# EasyEDA Pro project MSDR_EzEdaPro.eprj, board PCB5
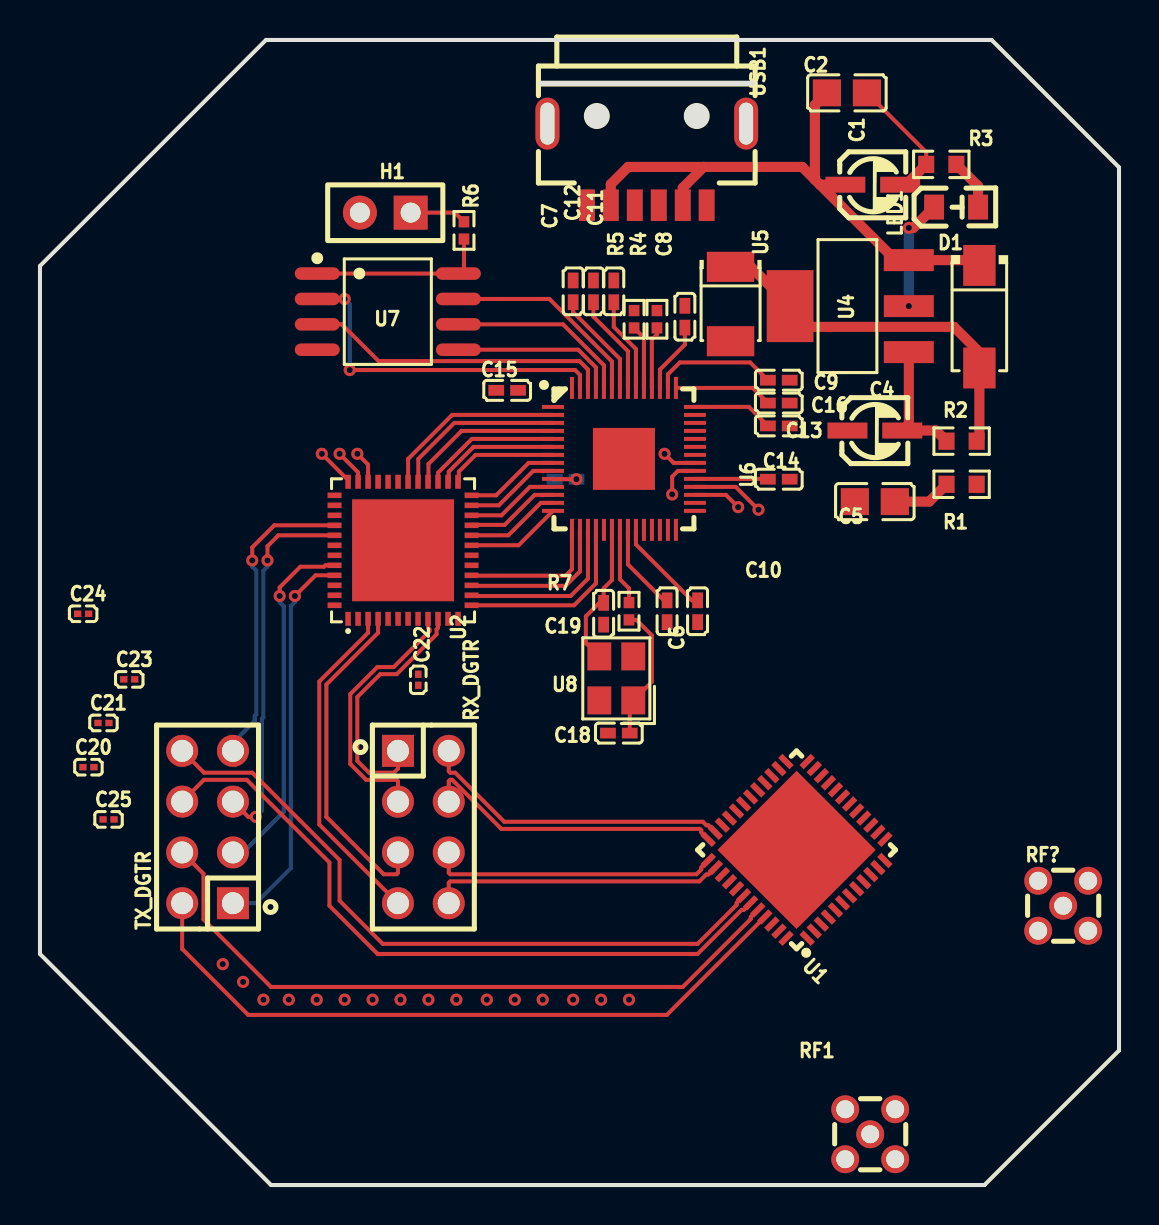
[diagram p4: board, top side]
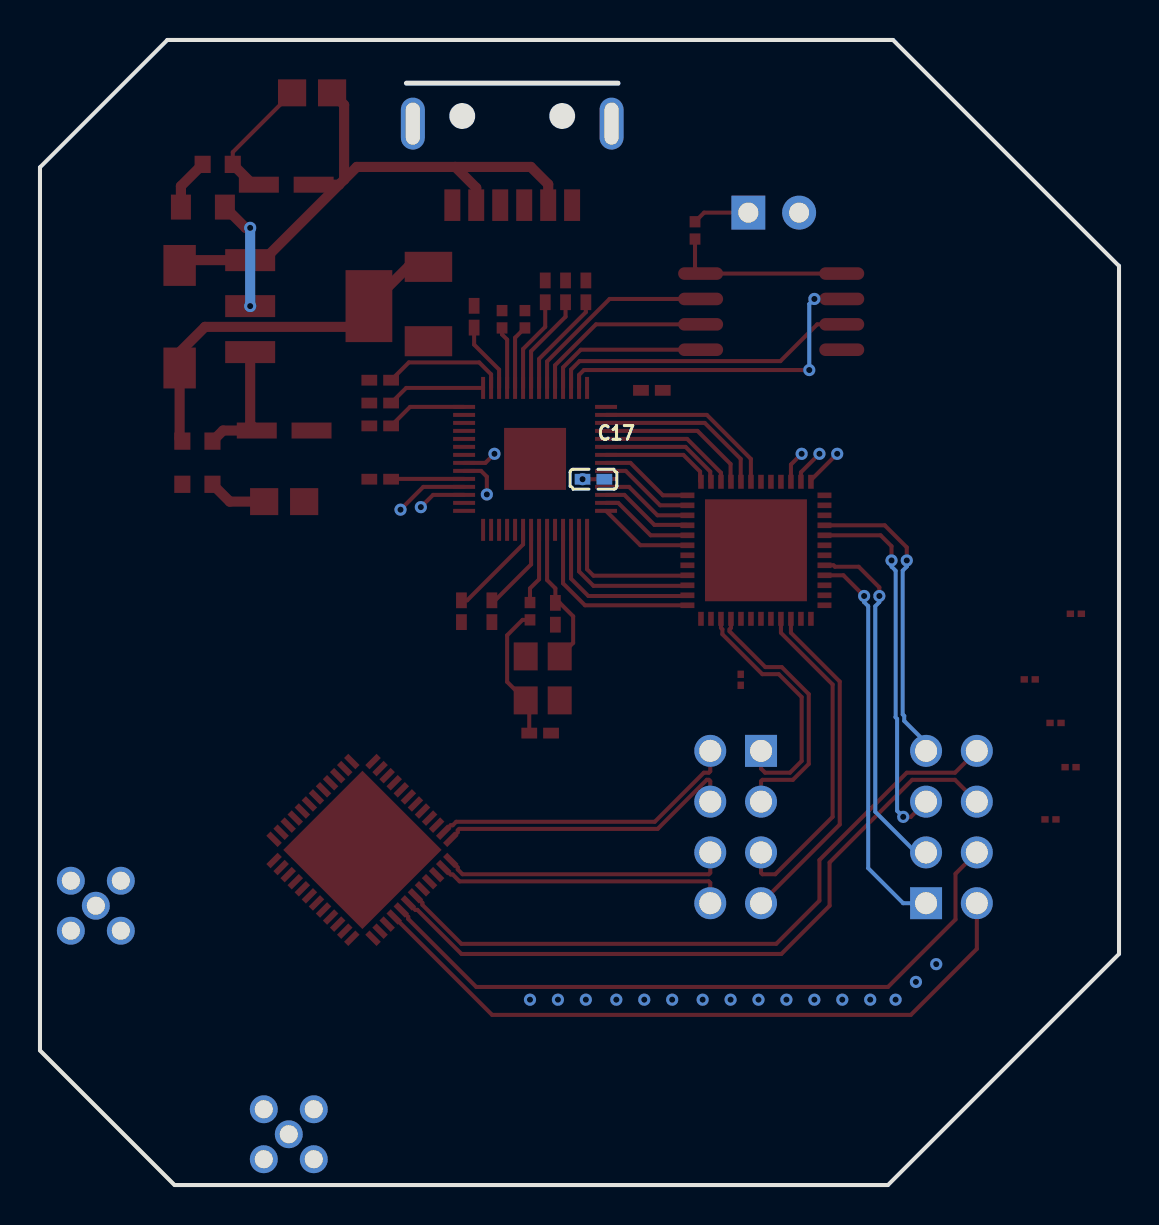
[diagram p5: board, bottom side, seen from below]

Outline 53.97 x 57.28 mm; copper layers: Top Layer, Bottom Layer. Coordinates in mm from the lower left corner of the outline.
Outline path: 0,45.97 11.3,57.28 47.6,57.28 53.97,50.91 53.97,6.73 47.24,0 11.56,0 0,11.56 0,45.97
Stack: Top Layer 0.035mm / Dielectric1 1.51mm FR4 er 4.5 / Bottom Layer 0.035mm

## Design rules (mm)
template: JLCPCB Capability(Two Layers Board)
spacing copperThickness1oz (default): track to track 0.102, other pairs 0.152 to 0.3
spacing copperThickness2oz: track to track 0.203, other pairs 0.152 to 0.3
track width copperThickness1oz (default): min 0.127, default 0.254, max 2.54
track width copperThickness2oz: min 0.203, default 0.254, max 2.54
differential pair differentialPair (default): width min 0.127, default 0.254, max 2.54; gap min 0.152, default 0.152
via viaSize (default): diameter min 0.5, default 0.61, max 10; hole min 0.3, default 0.305, max 6.3

## Placement (name value [footprint] x y rotation side)
C1  10uF  [CAP-SMD_BD3.0-L3.3-W3.3-RD]  41.66 50.04 180 top
C2  100nF  [C0805]  40.36 54.63 0 top
C4  10uF  [CAP-SMD_BD3.0-L3.3-W3.3-RD]  41.76 37.74 180 top
C5  100nF  [C0805]  41.76 34.19 0 top
C6  100nF  [C0402]  32.89 28.7 90 top
C7  100nF  [C0402]  26.67 44.7 270 top
C8  1uF  [C0402]  32.26 43.43 270 top
C9  1uF  [C0402]  36.96 40.26 180 top
C10  100nF  [C0402]  31.37 28.7 90 top
C11  100nF  [C0402]  28.7 44.7 270 top
C12  100nF  [C0402]  27.69 44.7 270 top
C13  100nF  [C0402]  36.96 37.97 180 top
C14  100nF  [C0402]  36.96 35.31 180 top
C15  100nF  [C0402]  23.37 39.75 0 top
C16  100nF  [C0402]  36.96 39.12 180 top
C17  100nF  [C0402]  26.29 35.31 0 bottom
C18  15p  [C0402]  28.96 22.61 0 top
C19  15p  [C0402]  28.19 28.58 270 top
C20  100nF  [C0201]  2.42 20.9 0 top
C21  100nF  [C0201]  3.17 23.11 0 top
C22  100nF  [C0201]  18.92 25.27 270 top
C23  100nF  [C0201]  4.47 25.29 0 top
C24  100nF  [C0201]  2.16 28.58 0 top
C25  100nF  [C0201]  3.43 18.29 0 top
D1  -  [SMA_L4.4-W2.8-LS5.4-RD]  46.99 43.43 270 top
H1  -  [HDR-TH_2P-P2.54-V-F]  17.27 48.64 180 top
LED1  -  [LED0805-RD_GREEN]  45.82 48.92 0 top
R1  10K  [R0603]  46.1 35.05 0 top
R2  10K  [R0603]  46.1 37.21 180 top
R3  10K  [R0603]  45.09 51.05 180 top
R4  10K  [R0402]  30.86 43.31 270 top
R5  10K  [R0402]  29.72 43.31 270 top
R6  1k  [R0402]  21.21 47.75 90 top
R7  10K  [R0402]  29.46 28.7 90 top
RF1  ZC11.801KK  [MMCX-TH_ZC11.801KK]  41.53 2.54 0 top
RF?  ZC11.801KK  [MMCX-TH_ZC11.801KK]  51.18 13.97 0 top
RX_DGTR  -  [HDR-TH_8P-P2.54-V-F-R2-C4-S2.54-1]  19.18 17.91 270 top
TX_DGTR  -  [HDR-TH_8P-P2.54-V-F-R2-C4-S2.54-1]  8.38 17.91 90 top
U1  MAX2831ETM+T  [TQFN-48_L7.0-W7.0-P0.50-TL-EP5.6]  37.85 16.76 135 top
U2  MAX5864ETM+  [QFN-48_L7.0-W7.0-P0.50-BL-EP5.1]  18.16 31.75 0 top
U4  AMS1117-3.3  [SOT-223-3_L6.5-W3.4-P2.30-LS7.0-BR]  40.49 43.96 0 top
U5  22uF  [CASE-B_3528]  34.54 44.07 270 top
U6  RP2040  [LQFN-56_L7.0-W7.0-P0.4-EP]  29.21 36.32 0 top
U7  W25Q128JVSIQ  [SOIC-8_L5.3-W5.3-P1.27-LS8.0-BL]  17.4 43.69 270 top
U8  ABM8-272-T3  [CRYSTAL-SMD_4P-L3.2-W2.5-BL]  28.83 25.34 90 top
USB1  USBC-0032IPX8-00  [TYPE-C-USB-SMD_USBC-0032IPX8-00]  30.35 51.05 180 top

## Footprints (pads in the part's own frame, mm; a bottom-side part is the same pattern mirrored in y, then rotated)
C0201
  rect 0.368x0.324 smd: 1(-0.275,0) 2(0.275,0)
C0402
  rect 0.79x0.54 smd: 1(-0.545,0) 2(0.545,0)
C0805
  rect 1.41x1.35 smd: 1(-1,0) 2(1,0)
CAP-SMD_BD3.0-L3.3-W3.3-RD
  rect 2x0.8 smd: 1(1.37,0) 2(-1.37,0)
CASE-B_3528
  rect 1.506x2.376 smd: 1(-1.861,0) 2(1.861,0)
CRYSTAL-SMD_4P-L3.2-W2.5-BL
  rect 1.4x1.2 smd: 1(-1.1,-0.85) 2(1.1,-0.85) 3(1.1,0.85) 4(-1.1,0.85)
HDR-TH_2P-P2.54-V-F
  rect 1.7x1.7 hole 1: 1(-1.27,0)
  round 1.7 hole 1: 2(1.27,0)
HDR-TH_8P-P2.54-V-F-R2-C4-S2.54-1
  rect 1.6x1.6 hole 1.1: 1(-3.81,-1.27)
  round 1.6 hole 1.1: 2(-3.81,1.27) 3(-1.27,-1.27) 4(-1.27,1.27) 5(1.27,-1.27) 6(1.27,1.27) 7(3.81,-1.27) 8(3.81,1.27)
LED0805-RD_GREEN
  rect 1x1.25 smd: 1(-1.1,0) 2(1.1,0)
LQFN-56_L7.0-W7.0-P0.4-EP
  rect 1.1x0.2 smd: 1(-3.55,2.6) 2(-3.55,2.2) 3(-3.55,1.8) 4(-3.55,1.4) 5(-3.55,1) 6(-3.55,0.6) 7(-3.55,0.2) 8(-3.55,-0.2) 9(-3.55,-0.6) 10(-3.55,-1) 11(-3.55,-1.4) 12(-3.55,-1.8) 13(-3.55,-2.2) 14(-3.55,-2.6) 29(3.55,-2.6) 30(3.55,-2.2) 31(3.55,-1.8) 32(3.55,-1.4) 33(3.55,-1) 34(3.55,-0.6) 35(3.55,-0.2) 36(3.55,0.2) 37(3.55,0.6) 38(3.55,1) 39(3.55,1.4) 40(3.55,1.8) 41(3.55,2.2) 42(3.55,2.6)
  rect 0.2x1.1 smd: 15(-2.6,-3.55) 16(-2.2,-3.55) 17(-1.8,-3.55) 18(-1.4,-3.55) 19(-1,-3.55) 20(-0.6,-3.55) 21(-0.2,-3.55) 22(0.2,-3.55) 23(0.6,-3.55) 24(1,-3.55) 25(1.4,-3.55) 26(1.8,-3.55) 27(2.2,-3.55) 28(2.6,-3.55) 43(2.6,3.55) 44(2.2,3.55) 45(1.8,3.55) 46(1.4,3.55) 47(1,3.55) 48(0.6,3.55) 49(0.2,3.55) 50(-0.2,3.55) 51(-0.6,3.55) 52(-1,3.55) 53(-1.4,3.55) 54(-1.8,3.55) 55(-2.2,3.55) 56(-2.6,3.55)
  rect 3.1x3.1 smd: 57(0,0)
MMCX-TH_ZC11.801KK
  round 1.4 hole 0.9: 1(0,0) 2(-1.25,1.25) 3(1.25,1.25) 4(1.25,-1.25) 5(-1.25,-1.25)
QFN-48_L7.0-W7.0-P0.50-BL-EP5.1
  rect 0.28x0.7 smd: 1(-2.75,-3.428) 2(-2.25,-3.428) 3(-1.75,-3.428) 4(-1.25,-3.428) 5(-0.75,-3.428) 6(-0.25,-3.428) 7(0.25,-3.428) 8(0.75,-3.428) 9(1.25,-3.428) 10(1.75,-3.428) 11(2.25,-3.428) 12(2.75,-3.428) 25(2.75,3.428) 26(2.25,3.428) 27(1.75,3.428) 28(1.25,3.428) 29(0.75,3.428) 30(0.25,3.428) 31(-0.25,3.428) 32(-0.75,3.428) 33(-1.25,3.428) 34(-1.75,3.428) 35(-2.25,3.428) 36(-2.75,3.428)
  rect 0.7x0.28 smd: 13(3.428,-2.75) 14(3.428,-2.25) 15(3.428,-1.75) 16(3.428,-1.25) 17(3.428,-0.75) 18(3.428,-0.25) 19(3.428,0.25) 20(3.428,0.75) 21(3.428,1.25) 22(3.428,1.75) 23(3.428,2.25) 24(3.428,2.75) 37(-3.428,2.75) 38(-3.428,2.25) 39(-3.428,1.75) 40(-3.428,1.25) 41(-3.428,0.75) 42(-3.428,0.25) 43(-3.428,-0.25) 44(-3.428,-0.75) 45(-3.428,-1.25) 46(-3.428,-1.75) 47(-3.428,-2.25) 48(-3.428,-2.75)
  rect 5.1x5.1 smd: 49(0,0)
R0402
  rect 0.566x0.54 smd: 1(-0.433,0) 2(0.433,0)
R0603
  rect 0.806x0.864 smd: 1(-0.753,0) 2(0.753,0)
SMA_L4.4-W2.8-LS5.4-RD
  rect 2.046x1.62 smd: 1(-2.566,0) 2(2.566,0)
SOIC-8_L5.3-W5.3-P1.27-LS8.0-BL
  oval 0.63x2.25 smd: 1(-1.905,-3.53) 2(-0.635,-3.53) 3(0.635,-3.53) 4(1.905,-3.53) 5(1.905,3.53) 6(0.635,3.53) 7(-0.635,3.53) 8(-1.905,3.53)
SOT-223-3_L6.5-W3.4-P2.30-LS7.0-BR
  rect 2.5x1.1 smd: 1(2.97,-2.3) 2(2.97,0) 3(2.97,2.3)
  rect 2.34x3.6 smd: 4(-2.97,0)
TQFN-48_L7.0-W7.0-P0.50-TL-EP5.6
  rect 0.8x0.3 smd: 1(-3.5,2.751) 2(-3.5,2.251) 3(-3.5,1.75) 4(-3.5,1.251) 5(-3.5,0.75) 6(-3.5,0.252) 7(-3.5,-0.249) 8(-3.5,-0.75) 9(-3.5,-1.25) 10(-3.5,-1.75) 11(-3.5,-2.249) 12(-3.5,-2.748) 25(3.5,-2.748) 26(3.5,-2.249) 27(3.5,-1.75) 28(3.5,-1.25) 29(3.5,-0.75) 30(3.5,-0.249) 31(3.5,0.252) 32(3.5,0.75) 33(3.5,1.251) 34(3.5,1.75) 35(3.5,2.251) 36(3.5,2.751)
  rect 0.3x0.8 smd: 13(-2.751,-3.5) 14(-2.251,-3.5) 15(-1.75,-3.5) 16(-1.25,-3.5) 17(-0.75,-3.5) 18(-0.251,-3.5) 19(0.249,-3.5) 20(0.75,-3.5) 21(1.25,-3.5) 22(1.75,-3.5) 23(2.251,-3.5) 24(2.751,-3.5) 37(2.751,3.5) 38(2.251,3.5) 39(1.75,3.5) 40(1.25,3.5) 41(0.75,3.5) 42(0.251,3.5) 43(-0.251,3.5) 44(-0.75,3.5) 45(-1.25,3.5) 46(-1.75,3.5) 47(-2.251,3.5) 48(-2.751,3.5)
  rect 5.6x5.6 smd: 49(0,0.001)
TYPE-C-USB-SMD_USBC-0032IPX8-00
  oval 1.2x2.6 hole 0.7x2.1: 7(-4.97,-2.04) 7(4.97,-2.04)
  rect 0.8x1.58 smd: A5(-0.6,2.04) A9(1.8,2.04) A12(2.995,2.04) B5(0.6,2.04) B9(-1.8,2.04) B12(-2.995,2.04)

## Nets
1.1V: C6.2 C7.2 C8.2 U6.23 U6.45 U6.50
3.3V: C9.2 C10.2 C11.2 C12.2 C13.2 C14.2 C15.2 C16.2 C17.2 C20.1 D1.2 R2.1 R6.1 U1.1 U1.7 U1.13 U1.17 U1.20 U1.25 U1.27 U1.30 U1.39 U1.41 U1.46 U2.33 U4.4 U5.1 U6.1 U6.10 U6.22 U6.33 U6.42 U6.43 U6.44 U6.48 U6.49 U6.56 U7.1 U7.8
+5V: C1.1 C2.1 D1.1 U4.3 USB1.A9 USB1.B9
GND: C1.2 C2.2 C4.1 C5.1 C6.1 C7.1 C8.1 C9.1 C10.1 C11.1 C12.1 C13.1 C14.1 C15.1 C16.1 C17.1 C18.1 C19.2 C21.2 C22.2 C23.2 C24.2 C25.2 H1.2 R1.2 R3.2 U1.2 U1.26 U1.31 U1.47 U2.5 U2.7 U2.12 U2.17 U2.37 U2.42 U2.47 U5.2 U6.19 U6.57 U7.4 U8.2 U8.4 USB1.A12 USB1.B12
BBC_CLK: U2.6 U6.36
BBC_CS: U2.36 U6.29
BBC_DA0: U2.13 U6.18
BBC_DA1: U2.14 U6.17
BBC_DA2: U2.15 U6.16
BBC_DA3: U2.16 U6.15
BBC_DA4: U2.19 U6.14
BBC_DA5: U2.20 U6.13
BBC_DA6: U2.21 U6.12
BBC_DA7: U2.22 U6.11
BBC_DD0: U2.23 U6.9
BBC_DD1: U2.24 U6.8
BBC_DD2: U2.25 U6.7
BBC_DD3: U2.26 U6.6
BBC_DD4: U2.27 U6.5
BBC_DD5: U2.28 U6.4
BBC_DD6: U2.29 U6.3
BBC_DD7: U2.30 U6.2
BBC_DIN: U2.34 U6.27
BBC_IN: TX_DGTR.3 U2.44
BBC_IP: TX_DGTR.1 U2.45
BBC_QN: TX_DGTR.7 U2.40
BBC_QP: TX_DGTR.5 U2.41
BBC_SCLK: U2.35 U6.28
RX_BBCIN: RX_DGTR.5 U2.4
RX_BBCIP: RX_DGTR.7 U2.3
RX_BBCQN: RX_DGTR.3 U2.9
RX_BBCQP: RX_DGTR.1 U2.10
RXN: U1.5
RXP: U1.4
TR_CLKOUT: U1.21 U6.35
TR_CS#: U1.15 U6.31
TR_DIN: U1.19 U6.34
TR_RXBBIN: RX_DGTR.6 U1.37
TR_RXBBIP: RX_DGTR.8 U1.38
TR_RXBBQN: RX_DGTR.2 U1.35
TR_RXBBQP: RX_DGTR.4 U1.36
TR_RXTX_MODE: U1.48
TR_SCLK: U1.18 U6.32
TR_SHDN#: U1.12 U6.30
TR_TXBBIN: TX_DGTR.4 U1.44
TR_TXBBIP: TX_DGTR.2 U1.45
TR_TXBBQN: TX_DGTR.8 U1.42
TR_TXBBQP: TX_DGTR.6 U1.43
TXN: U1.10
TXP: U1.9
USBC_DN: R4.1 USB1.A5
USBC_DP: R5.1 USB1.B5
$1N1972: LED1.1 U4.2
$1N2144: C4.2 C5.2 R1.1 R2.2 U4.1
$1N2960: LED1.2 R3.1
$1N3442: R5.2 U6.47
$1N3446: R4.2 U6.46
$1N4821: C20.2 U2.31 U2.32
$1N5034: U6.51 U7.7
$1N5044: U6.54 U7.3
$1N5058: U6.53 U7.5
$1N5070: U6.55 U7.2
$1N5085: U6.52 U7.6
$1N5173: H1.1 R6.2
$1N5390: C19.1 U6.20 U8.3
$1N5565: C18.2 R7.1 U8.1
$1N5572: R7.2 U6.21
$1N7470: C21.1 U2.2
$1N7508: C22.1 U2.8
$1N7546: C23.1 U2.11
$1N7584: C24.1 U2.18
$1N7821: C25.1 U2.39

Pads without a net: RF1 1 2 3 4 5; RF? 1 2 3 4 5; U1 3 6 8 11 14 16 22 23 24 28 29 32 33 34 40 49; U2 1 38 43 46 48 49; U6 24 25 26 37 38 39 40 41; USB1 7

## Via types
v1: diameter 0.61, hole 0.305, Top Layer to Bottom Layer, 33 vias

## Routing (per net, layer and track width the routed paths; a pad name or vN(x,y) marks a point on that pad's centre or on a via; arc(x,y) is an arc through that point)
1.1V: length 13.8
  Top Layer w0.203: C8.2 32.26,42.04 31.01,40.79 U6.45 ; C6.2 32.61,29.25 29.81,32.04 U6.23 ; C7.2 26.67,43.66 29.01,41.32 U6.50
3.3V: length 62.2
  Top Layer w0.203: v1(26.83,35.31) 25.68,35.31 U6.10 ; C11.2 28.7,42.93 29.81,41.82 U6.48 ; U7.1 U7.8 21.21,45.87 R6.1 ; U6.33 36.4,35.32 C14.2 ; C12.2 27.69,43.43 29.41,41.71 U6.49 ; U6.44 31.41,40.55 32,41.15 35.52,41.15 C9.2 ; U6.42 35.46,38.92 C13.2 ; C10.2 31.21,29.25 29.41,31.04 U6.22 ; U6.43 35.66,39.87 C16.2
  Top Layer w0.508: R2.1 46.99,37.35 D1.2 46.99,41.66 45.72,42.93 38.56,42.93 35.53,45.95 34.27,45.95
+5V: length 30.1
  Top Layer w0.508: 39.02,50.04 38.76,50.29 ; 39.02,50.04 C1.1 ; 39.02,50.04 42.79,46.26 U4.3 46.73,46.26 D1.1 ; 38.76,50.29 38.76,54.03 C2.1 ; 38.76,50.29 38.13,50.93 33.2,50.93 ; 32.15,49.01 32.15,49.88 33.2,50.93 ; 33.2,50.93 29.42,50.93 28.55,50.06 USB1.A9
GND: length 6.5
  Top Layer w0.203: C2.2 44.33,51.66 R3.2
  Top Layer w0.508: C1.2 43.32,50.04 R3.2
(no net):
  vias: v1(9.14,11.05) v1(10.16,10.16) v1(11.18,9.27) v1(12.45,9.27) v1(13.84,9.27) v1(15.24,9.27) v1(16.64,9.27) v1(18.03,9.27) v1(19.43,9.27) v1(20.83,9.27) v1(22.35,9.27) v1(23.75,9.27) v1(25.15,9.27) v1(26.67,9.27) v1(28.07,9.27) v1(29.46,9.27)
BBC_CS: length 1.9
  Top Layer w0.203: v1(14.1,36.58) 15.41,35.26 U2.36
BBC_DA0: length 9.4
  Top Layer w0.203: U6.18 27.81,30.1 26.71,29 U2.13
BBC_DA1: length 8.6
  Top Layer w0.203: U6.17 27.41,30.33 26.54,29.46 21.62,29.46 U2.14
BBC_DA2: length 7.8
  Top Layer w0.203: U2.15 21.62,29.97 26.29,29.97 27.01,30.69 U6.16
BBC_DA3: length 7.1
  Top Layer w0.203: U2.16 21.61,30.48 26.29,30.48 26.61,30.8 U6.15
BBC_DA4: length 4.8
  Top Layer w0.203: U2.19 21.59,32 23.94,32 U6.14
BBC_DA5: length 4.7
  Top Layer w0.203: U6.13 25.05,34.12 23.43,32.5 U2.20
BBC_DA6: length 4.7
  Top Layer w0.203: U6.12 24.74,34.52 23.24,33.02 21.61,33.02 U2.21
BBC_DA7: length 4.7
  Top Layer w0.203: U6.11 24.51,34.92 23.09,33.5 U2.22
BBC_DD0: length 4.8
  Top Layer w0.203: U6.9 24.67,35.72 22.95,34 U2.23
BBC_DD1: length 4.7
  Top Layer w0.203: U2.24 22.82,34.5 24.44,36.12 U6.8
BBC_DD2: length 5.6
  Top Layer w0.203: U2.25 20.96,35.22 20.96,35.69 21.79,36.52 U6.7
BBC_DD3: length 6.2
  Top Layer w0.203: U2.26 20.45,35.21 20.45,35.69 21.68,36.92 U6.6
BBC_DD4: length 6.9
  Top Layer w0.203: U2.27 19.91,35.63 21.6,37.32 U6.5
BBC_DD5: length 7.8
  Top Layer w0.203: U2.28 19.43,35.2 19.43,36.07 21.09,37.72 U6.4
BBC_DD6: length 8.6
  Top Layer w0.203: U2.29 18.92,35.19 18.92,36.32 20.72,38.12 U6.3
BBC_DD7: length 9.3
  Top Layer w0.203: U2.30 18.41,35.18 18.41,36.32 20.62,38.52 U6.2
BBC_DIN: length 1.6
  Top Layer w0.203: v1(15.88,36.58) 16.41,36.04 U2.34
BBC_IN: length 18
  Top Layer w0.203: U2.44 14.28,31 14.21,30.93 13.02,30.93 11.99,29.9 v1(11.99,29.46)
  Bottom Layer w0.203: TX_DGTR.3 9.81,16.48 10.01,16.48 12.19,18.67 12.19,28.96 11.99,29.16 v1(11.99,29.46)
BBC_IP: length 19.7
  Top Layer w0.203: U2.45 13.79,30.5 v1(12.75,29.46)
  Bottom Layer w0.203: v1(12.75,29.46) 12.75,29.16 12.55,28.96 12.55,15.85 10.79,14.1 TX_DGTR.1
BBC_QN: length 15.3
  Top Layer w0.203: v1(10.62,31.24) 10.62,31.9 11.72,33 U2.40
  Bottom Layer w0.203: TX_DGTR.7 9.65,22.12 10.74,23.22 10.74,23.47 10.82,23.54 10.82,30.73 10.62,30.94 v1(10.62,31.24)
BBC_QP: length 18.8
  Top Layer w0.203: TX_DGTR.5 10.41,18.42 v1(10.79,18.42) ; U2.41 11.93,32.5 11.38,31.95 v1(11.38,31.24)
  Bottom Layer w0.203: v1(10.79,18.42) 11.1,18.72 11.1,23.32 11.18,23.39 11.18,30.73 11.38,30.94 v1(11.38,31.24)
BBC_SCLK: length 1.8
  Top Layer w0.203: U2.35 15.91,35.65 v1(14.99,36.58)
RX_BBCIN: length 16.8
  Top Layer w0.203: 17.91,16.64 17.91,15.62 17.84,15.54 17.2,15.54 14.33,18.42 14.33,25.04 16.91,27.62 U2.4
RX_BBCIP: length 16.9
  Top Layer w0.203: 17.91,14.1 13.97,18.03 13.97,25.18 16.41,27.62 U2.3
RX_BBCQN: length 13.2
  Top Layer w0.203: 17.91,19.18 17.91,20.2 17.84,20.27 16.31,20.27 15.52,21.06 15.52,24.56 16.87,25.91 17.69,25.91 19.48,27.7 19.48,27.8 19.41,27.87 U2.9
RX_BBCQP: length 12.5
  Top Layer w0.203: U2.10 19.91,27.87 19.84,27.8 19.84,27.55 17.84,25.55 17.02,25.55 15.88,24.41 15.88,21.21 16.46,20.62 17.7,20.62 17.91,20.83 17.91,21.72
TR_CLKOUT: length 1.7
  Top Layer w0.203: v1(31.24,36.58) 31.7,36.12 U6.35
TR_CS#: length 2.4
  Top Layer w0.203: U6.31 34.31,34.52 v1(34.93,33.91)
TR_DIN: length 2.1
  Top Layer w0.203: v1(31.62,34.54) 31.62,35.43 31.91,35.72 U6.34
TR_RXBBIN: length 14.4
  Top Layer w0.203: U1.37 33.08,15.89 33.08,15.79 32.84,15.54 20.52,15.54 20.45,15.62 RX_DGTR.6
TR_RXBBIP: length 14.7
  Top Layer w0.203: RX_DGTR.8 20.45,15.12 20.52,15.19 32.99,15.19 33.33,15.53 33.43,15.53 U1.38
TR_RXBBQN: length 15.6
  Top Layer w0.203: RX_DGTR.2 20.45,20.7 20.52,20.62 20.77,20.62 23.22,18.17 33.16,18.17 33.33,17.99 33.43,17.99 U1.35
TR_RXBBQP: length 15.3
  Top Layer w0.203: RX_DGTR.4 20.45,20.2 20.52,20.27 20.62,20.27 23.07,17.82 33.01,17.82 33.08,17.74 33.08,17.64 U1.36
TR_SCLK: length 3.7
  Top Layer w0.203: v1(35.94,33.78) 34.8,34.92 U6.32
TR_TXBBIN: length 34.6
  Top Layer w0.203: 35.9,13.76 35.55,13.41 35.55,13.31 32.15,9.91 11.56,9.91 8.18,13.28 8.18,15.57 TX_DGTR.4
TR_TXBBIP: length 34.8
  Top Layer w0.203: TX_DGTR.2 7.11,11.81 10.41,8.51 31.36,8.51 36.25,13.41
TR_TXBBQN: length 34.3
  Top Layer w0.203: TX_DGTR.8 8.2,20.62 10.62,20.62 14.99,16.26 14.99,14.22 17.15,12.07 32.9,12.07 34.85,14.02 34.85,14.12 U1.42
TR_TXBBQP: length 34.8
  Top Layer w0.203: TX_DGTR.6 8.2,20.27 10.34,20.27 14.48,16.13 14.48,13.97 16.89,11.56 32.89,11.56 35.1,13.77 35.2,13.77 U1.43
$1N1972: length 5.6
  Top Layer w0.508: v1(43.46,47.88) 43.69,47.88 LED1.1
  Bottom Layer w0.508: v1(43.46,43.96) v1(43.46,47.88)
$1N2144: length 9.4
  Top Layer w0.508: R1.1 44.48,34.19 C5.2 ; R2.2 44.82,37.74 C4.2 43.46,38.07 U4.1
$1N2960: length 2.6
  Top Layer w0.508: LED1.2 46.93,49.97 R3.1
$1N3442: length 3.2
  Top Layer w0.203: R5.2 30.21,42.38 U6.47
$1N3446: length 3.1
  Top Layer w0.203: R4.2 30.86,42.55 30.61,42.29 30.61,39.88 U6.46
$1N5034: length 10.3
  Top Layer w0.203: 20.93,44.32 25.48,44.32 28.61,41.19 U6.51
$1N5044: length 15.4
  Top Layer w0.203: U6.54 27.41,40.79 26.99,41.21 16.93,41.21 15.1,43.05 U7.3
$1N5058: length 8.3
  Top Layer w0.203: U6.53 27.81,40.9 26.92,41.78 U7.5
$1N5070: length 17.3
  Top Layer w0.203: v1(15.24,44.32) 13.87,44.32 ; v1(15.49,40.77) 26.77,40.77 27.01,40.52 U6.55
  Bottom Layer w0.203: v1(15.24,44.32) 15.49,44.07 v1(15.49,40.77)
$1N5085: length 9.3
  Top Layer w0.203: U6.52 28.21,41.01 26.16,43.05 U7.6
$1N5173: length 2.9
  Top Layer w0.203: H1.1 20.75,48.64 R6.2
$1N5390: length 7.3
  Top Layer w0.203: U6.20 28.61,30.26 28.19,29.85 C19.1 27.98,29.12 27.31,28.45 27.31,27.12 U8.3
$1N5565: length 6.8
  Top Layer w0.203: R7.1 29.84,28.27 30.61,27.5 30.61,25.17 U8.1 29.5,24.06 C18.2
$1N5572: length 3.8
  Top Layer w0.203: 29.46,29.14 29.46,29.85 29.01,30.3 U6.21
